# EAGLE design led-ledshaped (EAGLE 6.5.0)
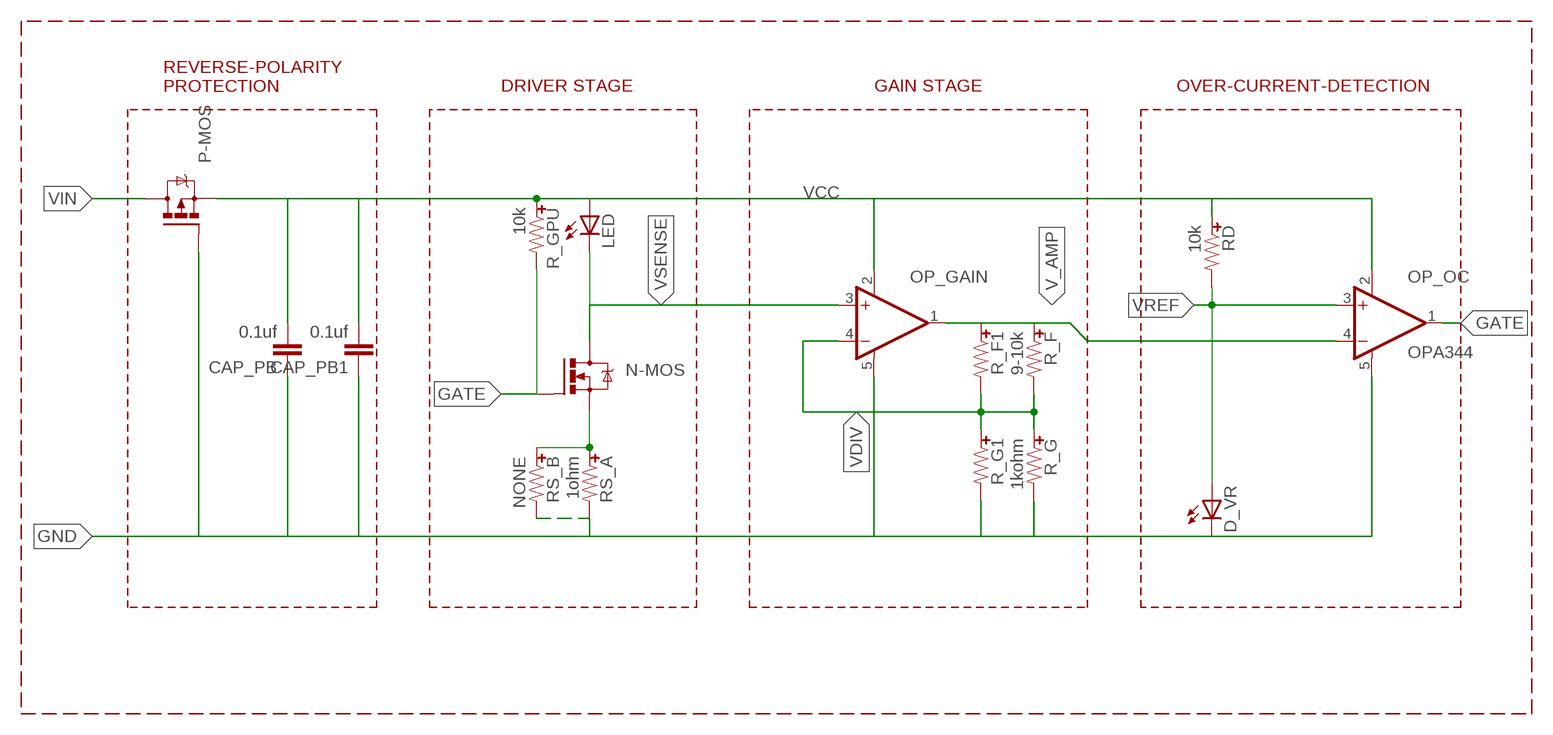
[diagram p0: schematic, sheet 1]

## Parts
CAP_PB  0.1uf  CAPUNIVERSAL  [0402-0603-0805-UNIVERSAL]
CAP_PB1  0.1uf  CAPUNIVERSAL  [0402-0603-0805-UNIVERSAL]
D_VR  LEDUNIVERSAL  [0402-0603-0805-UNIVERSAL]
LED  LEDUNIVERSAL  [0402-0603-0805-UNIVERSAL]
N-MOS  MOSFET-NCHANNELSMD  [SOT23-3]
OP_GAIN  OPA344  [SOT23-5]
OP_OC  OPA344  [SOT23-5]
P-MOS  MOSFET-PCHANNEL  [SOT23-3]
R_F  9-10k  RESISTORUNIVERSAL  [0402-0603-0805-UNIVERSAL]
R_F1  RESISTORUNIVERSAL  [0402-0603-0805-UNIVERSAL]
R_G  1kohm  RESISTORUNIVERSAL  [0402-0603-0805-UNIVERSAL]
R_G1  RESISTORUNIVERSAL  [0402-0603-0805-UNIVERSAL]
R_GPU  10k  RESISTORUNIVERSAL  [0402-0603-0805-UNIVERSAL]
RD  10k  RESISTORUNIVERSAL  [0402-0603-0805-UNIVERSAL]
RS_A  1ohm  RESISTORUNIVERSAL  [0402-0603-0805-UNIVERSAL]
RS_B  NONE  RESISTORUNIVERSAL  [0402-0603-0805-UNIVERSAL]

## Nets
GATE: N-MOS.1(G) OP_OC.1(OUT) R_GPU.-
GND: CAP_PB1.- CAP_PB.- D_VR.-(C) OP_GAIN.5(V+) OP_OC.5(V+) P-MOS.1(G) R_G1.- R_G.- RS_A.- RS_B.-
N$2: N-MOS.2(S) RS_A.+ RS_B.+
V_AMP: OP_GAIN.1(OUT) OP_OC.4(-IN) R_F1.+ R_F.+
VCC: CAP_PB1.+ CAP_PB.+ LED.+(A) OP_GAIN.2(V-) OP_OC.2(V-) P-MOS.2(S) R_GPU.+ RD.+
VDIV: OP_GAIN.4(-IN) R_F1.- R_F.- R_G1.+ R_G.+
VIN: P-MOS.3(D)
VREF: D_VR.+(A) OP_OC.3(+IN) RD.-
VSENSE: LED.-(C) N-MOS.3(D) OP_GAIN.3(+IN)

## Notes on the sheet
- REVERSE-POLARITY
  PROTECTION
- DRIVER STAGE | GAIN STAGE | OVER-CURRENT-DETECTION

## Library data of the parts
CAP_PB CAP_PB1 = tekdemo:CAP: Capacitor Standard 0603 ceramic capacitor, and 0.1" leaded capacitor.
D_VR LED = tekdemo:LED: LEDs Standard schematic elements and footprints for 5mm, 3mm, 1206, and 0603 sized LEDs. 5mm - Spark Fun Electronics SKU : Comp-SBL
N-MOS = tekdemo:MOSFET-NCHANNEL: Generic NMOS footprint
OP_GAIN OP_OC = SparkFun-AnalogIC:OPA344: Single gate rail-to-rail output op-amp. Inputs extend 300mV past rails.
P-MOS = tekdemo:MOSFET-PCHANNEL: Generic PMOSFET; PROD_ID: TRANS-08285
R_F R_F1 R_G R_G1 R_GPU RD RS_A RS_B = tekdemo:RESISTOR: Resistor Basic schematic elements and footprints for 0603, 1206, and PTH resistors.

## Board
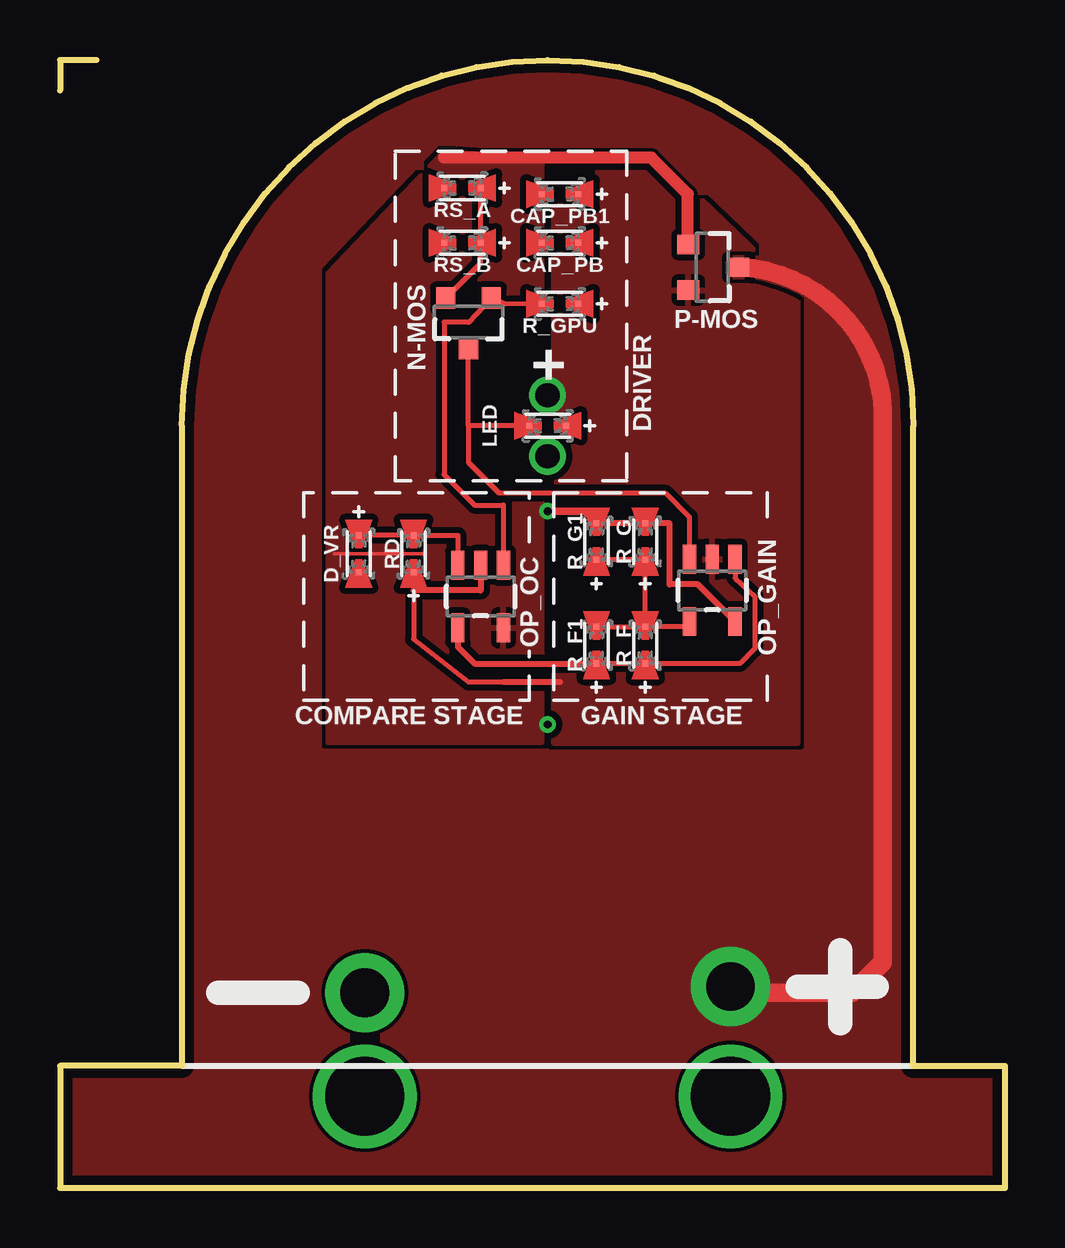
[diagram p1: board, top side]
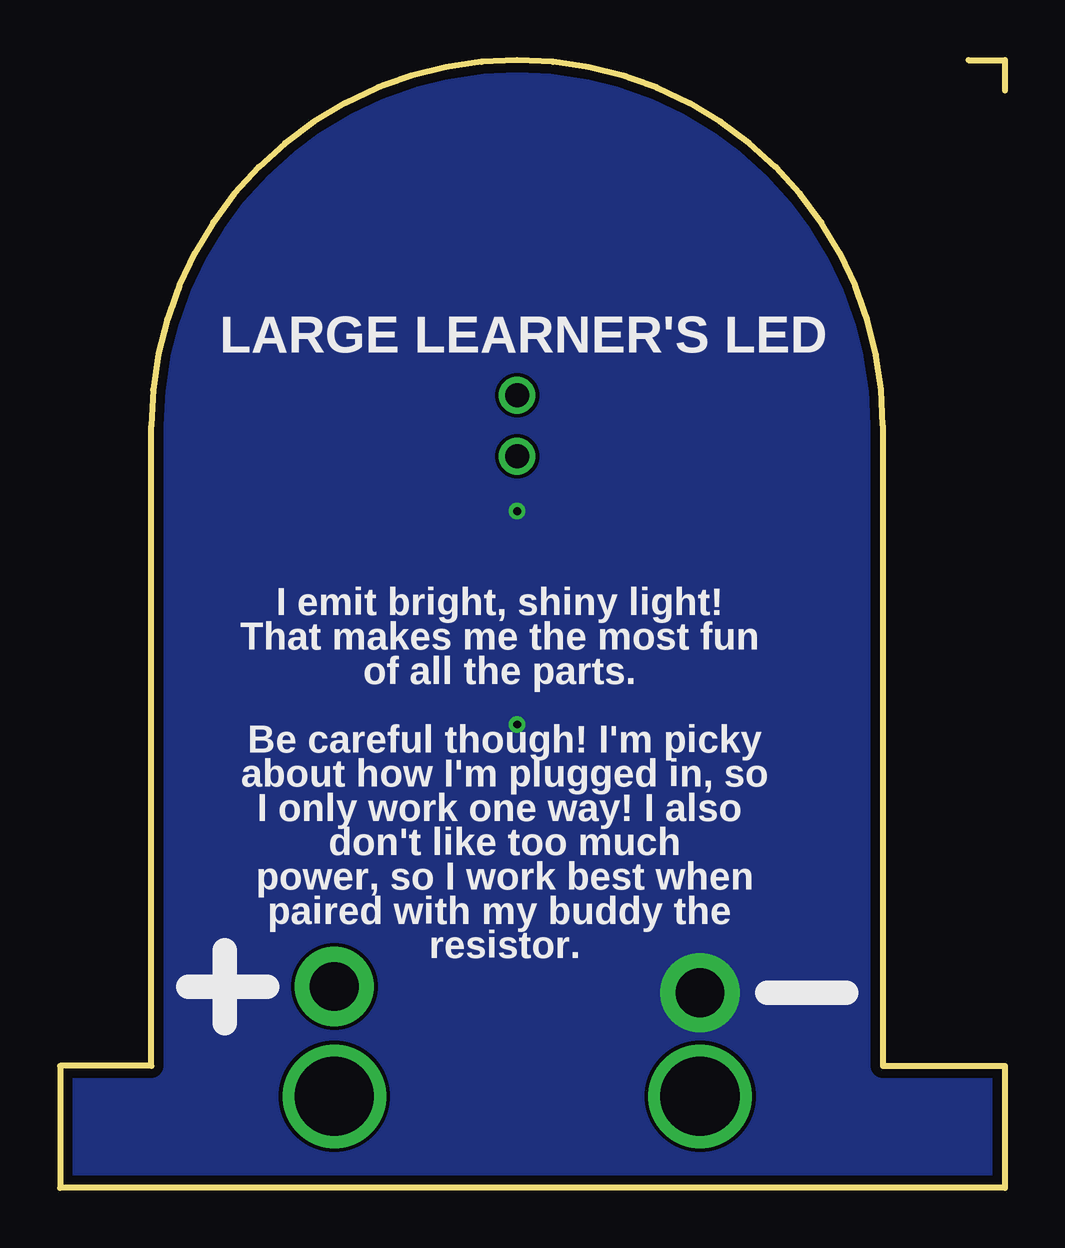
[diagram p2: board, bottom side, seen from below]

Size 39.37 x 46.99 mm. Coordinates in mm from the lower left corner, seen from the top.
Outline: 1.52,46.99 0,46.99 0,45.72
Outline: 5.08,31.75 5.08,5.08 0,5.08 0,0 39.37,0 39.37,5.08 35.56,5.08 35.56,31.75 arc180 5.08,31.75
Copper layers (1*16): Top 0.0356mm / dielectric 1.5011mm / Bottom 0.0356mm
Design rules "LaenPCBOrder *": minimum track width 6mil, minimum drill 13mil, track to track 6mil, track to pad 6mil, pad to pad 6mil, via to via 6mil, smd to smd 6mil, copper to edge 15mil, drill to drill 6mil, minimum pad ring 7mil, minimum via ring 7mil, stop-mask expansion 4mil, vias tented up to drill 20mil, thermal gap 10mil

### Footprints (pad centres in the part's own frame; a part is rotated, then mirrored left to right if it is on the bottom)
0402-0603-0805-UNIVERSAL = smd 0.254 x 0.254: + -0.762,0; - 0.762,0
SOT23-3 = smd 0.8 x 0.9: 1 -0.95,-1; 2 0.95,-1; 3 0,1.1
SOT23-5 = smd 0.55 x 1.2: 1 -0.95,-1.3; 2 0,-1.3; 3 0.95,-1.3; 4 0.95,1.3; 5 -0.95,1.3

### Placement (x,y rotation side)
CAP_PB  20.83,39.37 180 top
CAP_PB1  20.83,41.4 180 top
D_VR  12.45,26.42 270 top
LED  20.32,31.75 180 top
N-MOS  17.02,36.07 180 top
OP_GAIN  27.18,24.89 180 top
OP_OC  17.53,24.64 180 top
P-MOS  27.18,38.35 270 top
R_F  24.38,22.61 90 top
R_F1  22.35,22.61 90 top
R_G  24.38,26.92 90 top
R_G1  22.35,26.92 90 top
R_GPU  20.83,36.83 180 top
RD  14.73,26.42 90 top
RS_A  16.76,41.66 180 top
RS_B  16.76,39.37 180 top

### Tracks (layer width: path | path; a pad name or v marks a point on that pad's centre or on a via)
GATE
  Top 0.203: OP_OC.1 18.48,28.45 17.27,28.45 16,29.72 16,36.07 17.02,36.07 17.02,36.05 N-MOS.1 18.54,36.81 R_GPU.-
GND  (via drill 0.33, 2.03 pad 3.3)
  Top 0.152: 15.24,26.42 11.43,26.42
  Top 0.254: OP_GAIN.5 26.57,25.15 25.4,25.15 25.4,27.69 R_G.- R_G1.- 21.84,28.19
  Top 0.305: v20.32,28.19 21.84,28.19
  Top 0.508: P-MOS.1 26.16,39.57 26.16,41.4 24.64,42.93 16,42.93
  other vias: 12.7,8.13 20.32,19.3
  pour Top (isolate 0.254): 11.18,38.1 16,43.18 20.07,42.93 20.07,18.54 11.18,18.54
  pour Bottom: -10.16,63.5 -10.16,6.98 -10.29,0.25 52.58,0.25 53.34,63.5
N$2
  Top 0.203: N-MOS.2 17.53,38.53 RS_B.+ RS_A.+
N$4  (via drill 3.3)
  other vias: 12.7,3.81
N$5  (via drill 3.3)
  other vias: 27.94,3.81
V_AMP
  Top 0.203: OP_GAIN.1 28.13,25.4 28.96,24.64 28.96,22.48 28.32,21.84 R_F.+ R_F1.+
  Top 0.254: OP_OC.4 16.58,22.54 17.27,21.84 R_F1.+
VCC  (via drill 1.02)
  Top 0.203: RD.+ 14.73,24.89 14.73,22.86 17.02,21.08 18.48,21.08
  Top 0.254: 18.48,21.08 20.83,21.08 | OP_OC.2 17.53,24.89 14.73,24.89
  other vias: 20.32,33.02
  pour Top (isolate 0.254): 20.57,42.93 20.57,18.54 30.73,18.54 30.73,37.34 24.64,43.18
VDIV
  Top 0.203: R_F.- R_G.+ R_G1.+ | R_F1.- R_F.- | OP_GAIN.4 26.23,23.37 R_F.-
VIN  (via drill 2.03 pad 3.3)
  Top 0.254: v27.94,8.38 28.19,8.13
  Top 0.762: 28.19,8.13 33.02,8.13 34.29,9.4 34.29,31.83 arc90 P-MOS.3
  pour Top (rank 6): 0,0 0,26.67 arc-90 20.32,46.99 arc-82 39.37,30.48 39.37,0
VREF
  Top 0.203: D_VR.+ RD.- 16.58,27.18 OP_OC.3
VSENSE  (via drill 1.02)
  Top 0.152: LED.- 20.32,30.99 v20.32,30.48
  Top 0.203: OP_GAIN.3 26.23,27.94 25.21,28.96 18.29,28.96 17.02,30.23 17.02,31.75 | 17.02,31.75 N-MOS.3 | LED.- 17.02,31.75

### Text on the board
tPlace: DRIVER | + | COMPARE STAGE | GAIN STAGE
bPlace: LARGE LEARNER'S LED | I emit bright, shiny light! / That makes me the most fun / of all the parts. / / Be careful though! I'm picky / about how I'm plugged in, so / I only work one way! I also / don't like too much / power, so I work best when / paired with my buddy the / resistor.